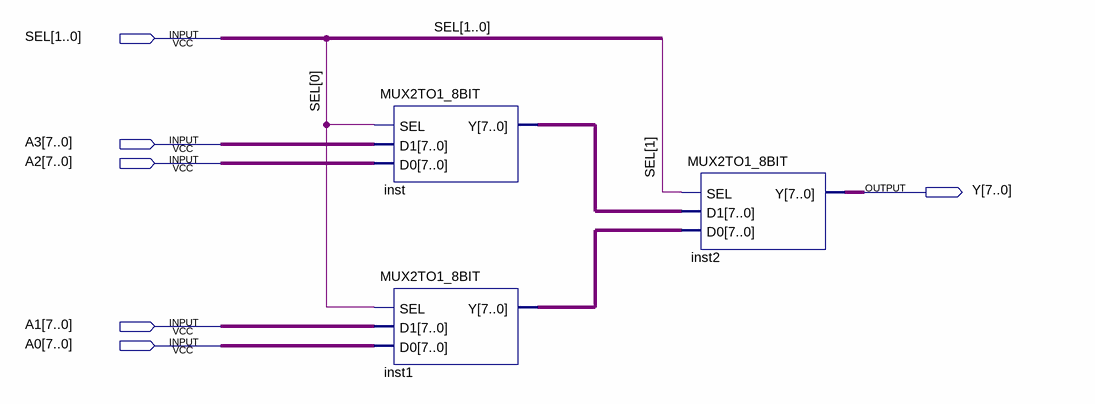
[diagram p0: schematic sheet]
// Quartus schematic MUX4TO1_8BIT.bdf as structural Verilog: 3 symbols, 6 pins
module MUX4TO1_8BIT (
  input  [1:0] SEL,
  input  [7:0] A3,
  input  [7:0] A2,
  input  [7:0] A1,
  input  [7:0] A0,
  output [7:0] Y
);

  wire [7:0] inst1_y, inst_y;

  MUX2TO1_8BIT inst (.SEL(SEL[0]), .D1(A3), .D0(A2), .Y(inst_y));
  MUX2TO1_8BIT inst1 (.SEL(SEL[0]), .D1(A1), .D0(A0), .Y(inst1_y));
  MUX2TO1_8BIT inst2 (.SEL(SEL[1]), .D1(inst_y), .D0(inst1_y), .Y(Y));
endmodule
